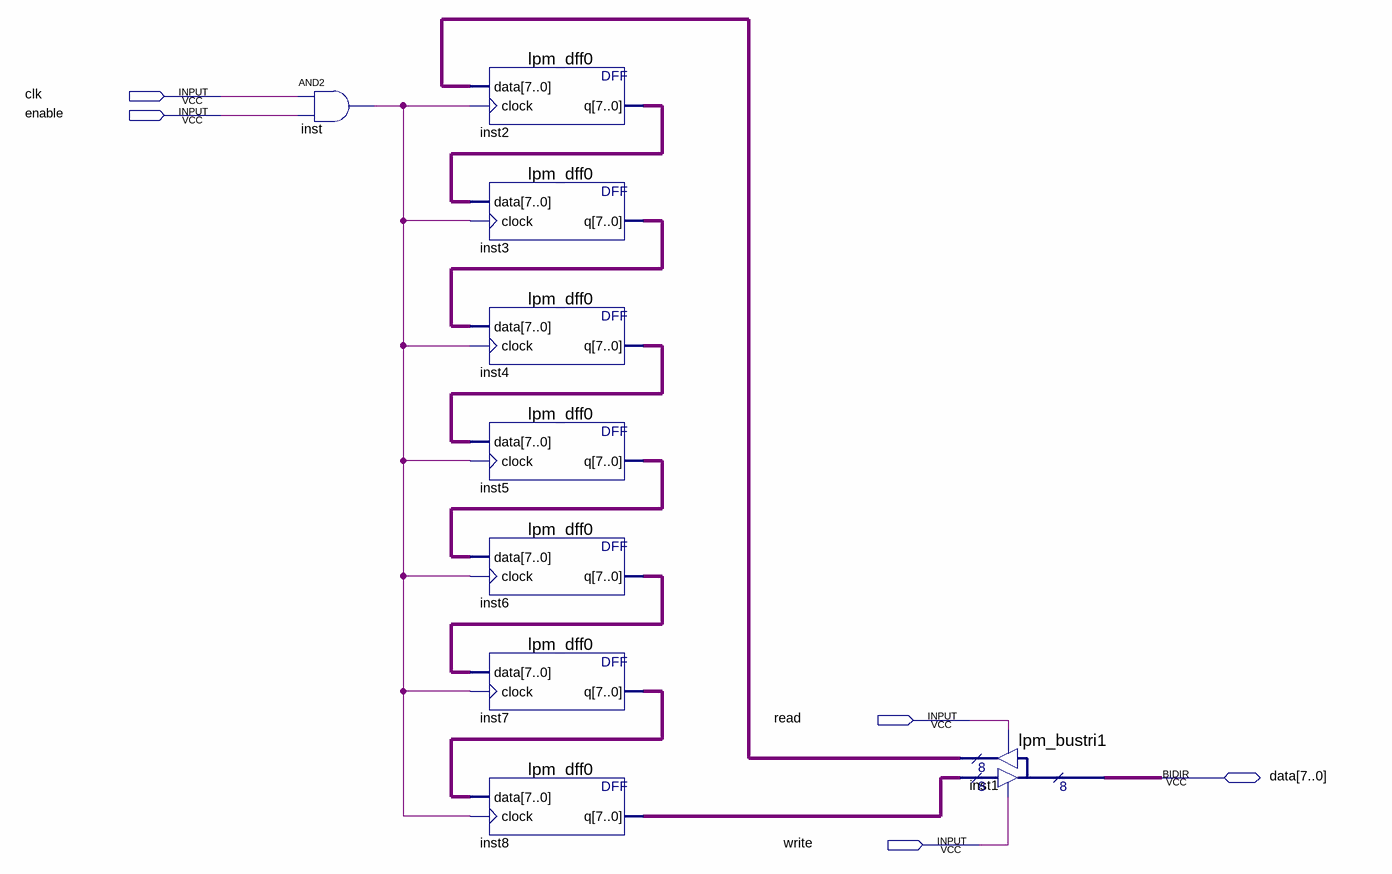
[diagram p0: schematic sheet]
// Quartus schematic buffer.bdf as structural Verilog: 9 symbols, 5 pins
module buffer (
  input  clk,
  input  enable,
  input  read,
  input  write,
  inout  [7:0] data
);

  wire inst_out;
  wire [7:0] inst1_result, inst2_q, inst3_q, inst4_q, inst5_q, inst6_q, inst7_q, inst8_q;

  and inst (inst_out, clk, enable);
  lpm_dff0 inst2 (.data(inst1_result), .clock(inst_out), .q(inst2_q));
  lpm_dff0 inst3 (.data(inst2_q), .clock(inst_out), .q(inst3_q));
  lpm_dff0 inst4 (.data(inst3_q), .clock(inst_out), .q(inst4_q));
  lpm_dff0 inst5 (.data(inst4_q), .clock(inst_out), .q(inst5_q));
  lpm_dff0 inst6 (.data(inst5_q), .clock(inst_out), .q(inst6_q));
  lpm_dff0 inst7 (.data(inst6_q), .clock(inst_out), .q(inst7_q));
  lpm_dff0 inst8 (.data(inst7_q), .clock(inst_out), .q(inst8_q));
  lpm_bustri1 inst1 (.enabledt(write), .data(inst8_q), .enabletr(read), .result(inst1_result), .tridata(data));
endmodule
